# EAGLE schematic esp8266_aquarium_light (EAGLE 9.5.0)
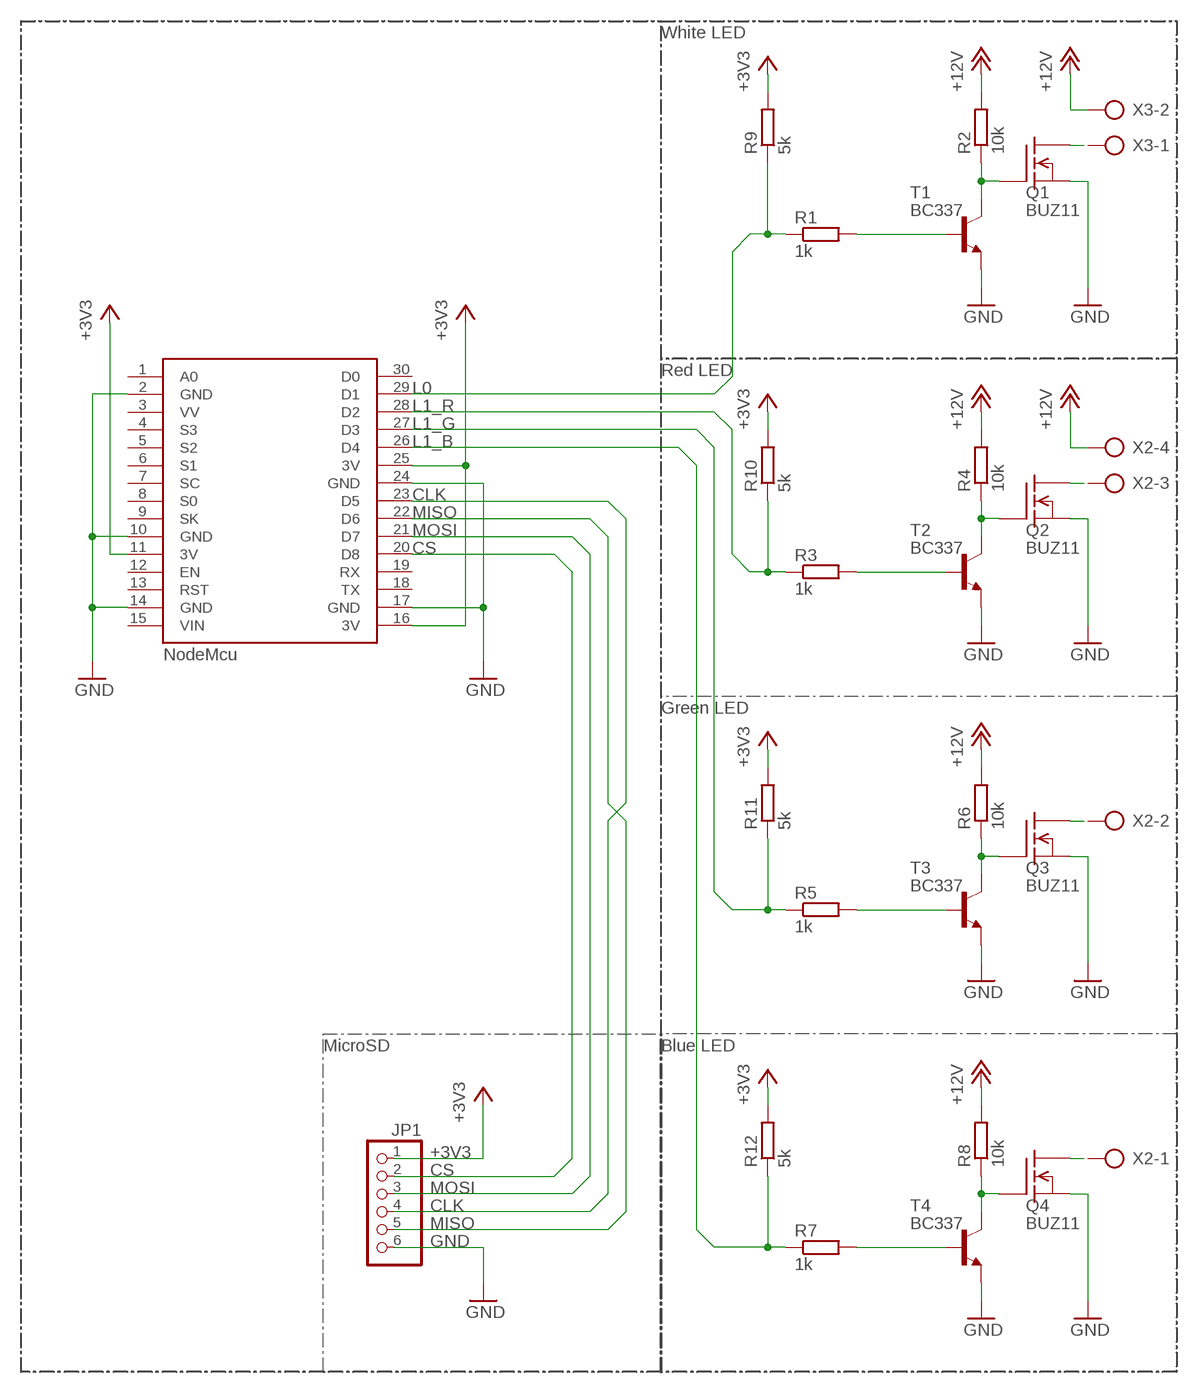
[diagram p0: schematic, sheet 1]

## Parts
JP1  PINHD-1X6  [1X06]
Q1  BUZ11  [TO220]
Q2  BUZ11  [TO220]
Q3  BUZ11  [TO220]
Q4  BUZ11  [TO220]
R1  1k  R-EU_0309/12  [0309/12]
R2  10k  R-EU_0309/12  [0309/12]
R3  1k  R-EU_0309/12  [0309/12]
R4  10k  R-EU_0309/12  [0309/12]
R5  1k  R-EU_0309/12  [0309/12]
R6  10k  R-EU_0309/12  [0309/12]
R7  1k  R-EU_0309/12  [0309/12]
R8  10k  R-EU_0309/12  [0309/12]
R9  5k  R-EU_0309/12  [0309/12]
R10  5k  R-EU_0309/12  [0309/12]
R11  5k  R-EU_0309/12  [0309/12]
R12  5k  R-EU_0309/12  [0309/12]
T1  BC337  [TO92]
T2  BC337  [TO92]
T3  BC337  [TO92]
T4  BC337  [TO92]
U$1  NODEMCU  [NODEMCU]
X2  AK500/4  [AK500/4]
X3  AK500/2  [AK500/2]

## Nets
+3V3: JP1.1 R9.2 R10.2 R11.2 R12.2 U$1.11(3V) U$1.16(3V) U$1.25(3V)
+12V: R2.2 R4.2 R6.2 R8.2 X2.4 X3.2
CLK: JP1.4 U$1.23(D5)
CS: JP1.2 U$1.20(D8)
GND: JP1.6 Q1.3(S) Q2.3(S) Q3.3(S) Q4.3(S) T1.1(E) T2.1(E) T3.1(E) T4.1(E) U$1.2(GND) U$1.10(GND) U$1.14(GND) U$1.17(GND) U$1.24(GND)
L0: R1.1 R9.1 U$1.29(D1)
L1_B: R7.1 R12.1 U$1.26(D4)
L1_G: R5.1 R11.1 U$1.27(D3)
L1_R: R3.1 R10.1 U$1.28(D2)
MISO: JP1.5 U$1.22(D6)
MOSI: JP1.3 U$1.21(D7)
N$1: R1.2 T1.2(B)
N$2: Q1.1(G) R2.1 T1.3(C)
N$3: R3.2 T2.2(B)
N$4: Q2.1(G) R4.1 T2.3(C)
N$5: R5.2 T3.2(B)
N$6: Q3.1(G) R6.1 T3.3(C)
N$7: R7.2 T4.2(B)
N$8: Q4.1(G) R8.1 T4.3(C)
N$9: Q2.2(D) X2.3
N$10: Q1.2(D) X3.1
N$11: Q3.2(D) X2.2
N$12: Q4.2(D) X2.1
Unconnected: U$1.1(A0) U$1.3(VV) U$1.4(S3) U$1.5(S2) U$1.6(S1) U$1.7(SC) U$1.8(S0) U$1.9(SK) U$1.12(EN) U$1.13(RST) U$1.15(VIN) U$1.18(TX) U$1.19(RX) U$1.30(D0)

## Notes on the sheet
- White LED
- Red LED
- NodeMcu
- Green LED
- MicroSD | Blue LED

## Library data of the parts
JP1 = pinhead:PINHD-1X6: PIN HEADER
Q1-Q4 = transistor-fet:BUZ11: N-Channel Enhancement MOSFET 50V; 30A; 0,040Ohm
R1-R12 = resistor:R-EU_: RESISTOR, European symbol
T1-T4 = transistor:BC337: NPN TRANSISTOR
U$1 = nodemcu:NODEMCU
X2 = con-ptr500:AK500/4: CONNECTOR; OC_FARNELL: unknown; OC_NEWARK: unknown
X3 = con-ptr500:AK500/2: CONNECTOR; OC_FARNELL: unknown; OC_NEWARK: unknown